# Altium schematic sheet USB_C.SchDoc: MISKO 3.0
size A4; Date: 19.9.2021; Author: AMADEJ PAPEŽ; SheetNumber: 2; SheetTotal: 13; SheetTitle: USB_C; Version: V1.1
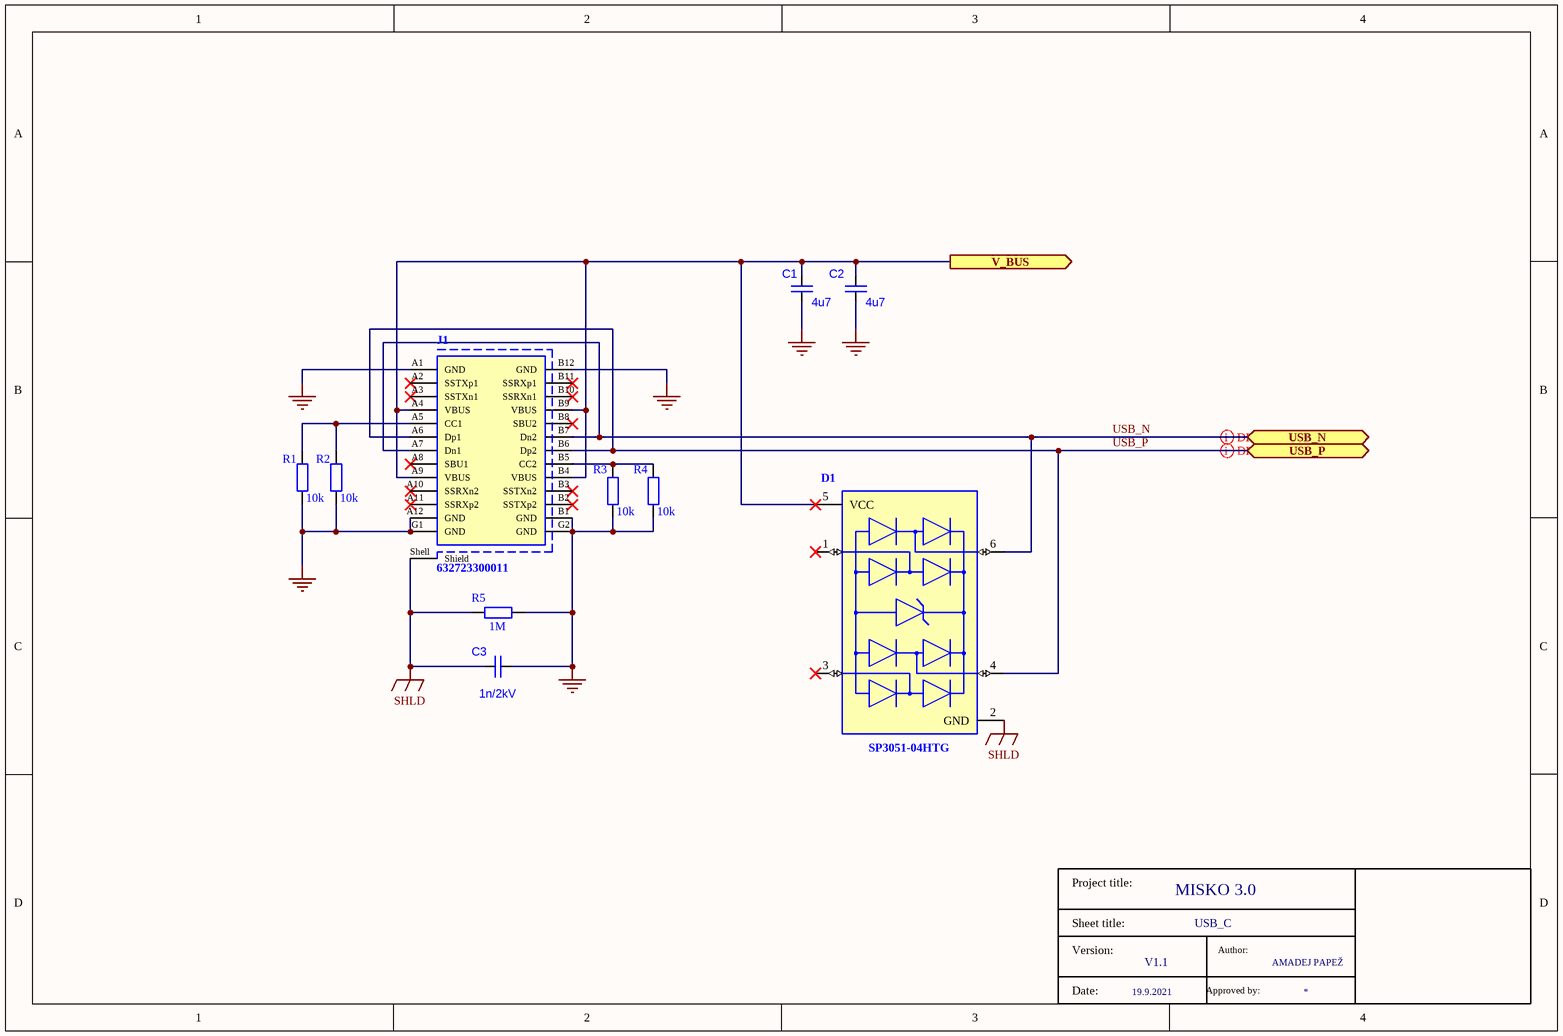
[diagram p0: USB_C.SchDoc]

## Parts
C1  value 4u7  [C0603]
C2  value 4u7  [C0603]
C3  value 1n/2kV  [C1206]
D1  SP3051-04HTG  [FP-SP3051-IPC_C]
J1  632723300011  [632723300011]
R1  value 10k  [R1608_0603I_L]
R2  value 10k  [R1608_0603I_L]
R3  value 10k  [R1608_0603I_L]
R4  value 10k  [R1608_0603I_L]
R5  value 1M  [R1608_0603I_L]
T2  (no value)

## Ports
USB_N (bidir), USB_P (bidir), V_BUS (out)

## Nets
GND: C1.1 C2.1 C3.1 J1.A1(GND) J1.A12(GND) J1.B1(GND) J1.B12(GND) J1.G1(GND) J1.G2(GND) R1.2 R2.2 R3.2 R4.2 R5.2
SHLD: C3.2 D1.2(GND) J1.Shell(Shield) R5.1
USB_N: D1.6(I/O_4) J1.A7(Dn1) J1.B7(Dn2) ; port USB_N
USB_P: D1.4(I/O_3) J1.A6(Dp1) J1.B6(Dp2) ; port USB_P
V_BUS: C1.2 C2.2 D1.5(VCC) J1.A4(VBUS) J1.A9(VBUS) J1.B4(VBUS) J1.B9(VBUS) ; port V_BUS
NetJ1_A5: J1.A5(CC1) R1.1 R2.1
NetJ1_B5: J1.B5(CC2) R3.1 R4.1

Not connected (* = marked no-connect by the designer): D1 1(I/O_1)* 3(I/O_2)*; J1 A2(SSTXp1)* A3(SSTXn1)* A8(SBU1)* A10(SSRXn2)* A11(SSRXp2)* B2(SSTXp2)* B3(SSTXn2)* B8(SBU2)* B10(SSRXn1)* B11(SSRXp1)*

## Layout directives
differential pair: USB_N, USB_P

## Notes on the sheet
- (in symbol Title block) Project title:; Sheet title:; Version:; Author:; Date:; Approved by:

## Library data of the parts
C1 C2 = C: Capacitor; Code: NB7-4U7-25V
C3 = C: Capacitor; Code: NH4-1N2KV
D1 = SP3051-04HTG: TVS DIODE 6V 17V SOT23-6; Manufacturer: Littelfuse; Peak Pulse Current: 20A; Capacitance: 1.7pF; Number Of Channels: 4; Breakdown Voltage: 8V; Standoff Height: 0mm; Direction: Unidirectional; Peak Pulse Power: 400W; Clamping Voltage: 14.3V; Code: KDSP3051; RoHS: TRUE; Temperature Range High: +125°C; Manufacturer Part Number: SP3051-04HTG; Automotive: No; Device Class L2: TVS Diodes; Reverse Standoff Voltage: 6V; ComponentLink2URL: https://www.littelfuse.com/~/media/electronics/datasheets/tvs_diode_arrays/littelfuse_tvs_diode_array_sp3051_datasheet.pdf.pdf; Mouser Description: TVS Diodes / ESD Suppressors 6V 20A for Lightning Surge PRO SOT23-6; Lead Free: Yes; Ipc Land Pattern Name: SOT95P280X118-6; Octopart: https://octopart.com/sp3051-04htg-littelfuse-29505621; Digikey Description: TVS DIODE 6V 17V SOT23-6; Device Class L3: unset; Temperature Range Low: -40°C; Height: 1.45mm; Temperature: -40°C to +125°C; Category: Diode; Package: SP3051; ComponentLink2Description: Datasheet; Device Class L1: Circuit Protection
J1 = 632723300011: USB 3.1 Type C Receptacle WR-COM, Horizontal, SMT / THT; Manufacturer: Wurth Electronics; Rated Current: 5A; Contact Resistance: 30mOhm; Working Voltage: 20VDC; Code: QBUSB-TYPEC-TM; Operating Temperature: -40to105degC; Package Reference: 632723300011; Datasheet URL: https://katalog.we-online.de/em/datasheet/632723x00011%282%29.pdf; Manufacturer URL: http://www.we-online.de; Connector Type: USB3.1TypeC; Gender: Receptacle; Part Number: 632723300011; Mounting Technology: SMT/THT; Publisher: WurthElektronik; Packaging: TapeandReel; Orientation: Horizontal; Manufacturer Part Number: 632723300011
R1-R4 = R: Code: LC5-10K
R5 = R: Code: LC7-1M
T2 = Title block